# Altium schematic sheet RPL_CAN.SchDoc: CAN Bus Interface
size A; Date: Dec 27, 2017; DrawnBy: Seyed Omid Hasanli; Revision: 1.0; SheetNumber: 8
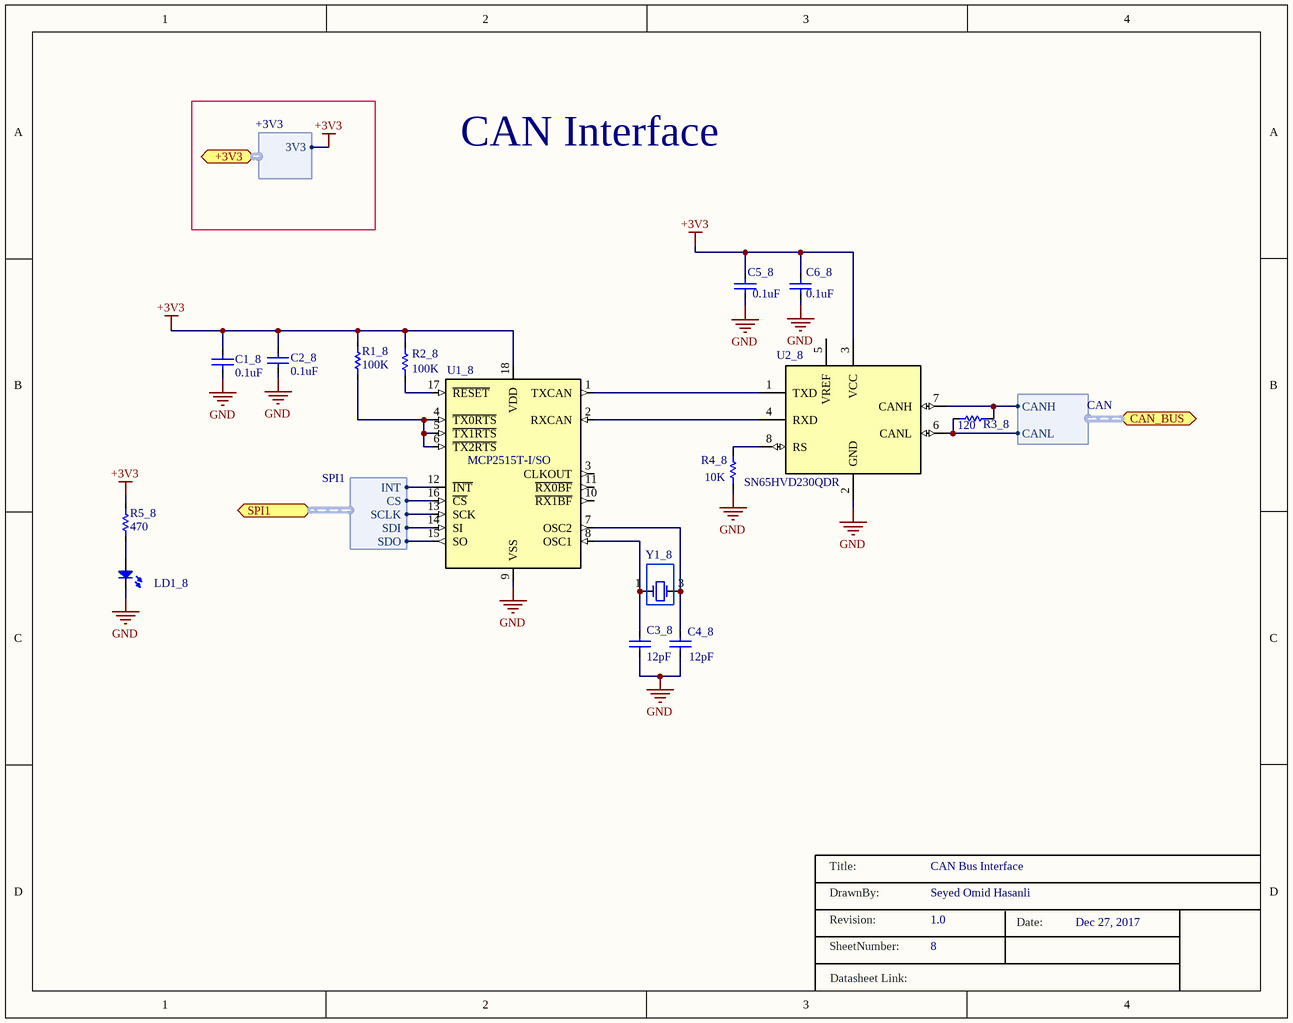
[diagram p0: RPL_CAN.SchDoc]

## Parts
C1_8  value 0.1uF  [C0805C475K9RACAUTO]  (hidden comment: Cap)
C2_8  value 0.1uF  [C0805C475K9RACAUTO]  (hidden comment: Cap)
C3_8  value 12pF  [C0805C475K9RACAUTO]  (hidden comment: Cap)
C4_8  value 12pF  [C0805C475K9RACAUTO]  (hidden comment: Cap)
C5_8  value 0.1uF  [C0805C475K9RACAUTO]  (hidden comment: Cap)
C6_8  value 0.1uF  [C0805C475K9RACAUTO]  (hidden comment: Cap)
LD1_8  LED LTST-C190GKT  [LEDM1608X80_LTST-C190GKT(Primary)]  (value not drawn)
R1_8  value 100K  [RES 0805]  (hidden comment: Res)
R2_8  value 100K  [RES 0805]  (hidden comment: Res)
R3_8  value 120  [RES 0805]  (hidden comment: Res)
R4_8  value 10K  [RES 0805]  (hidden comment: Res)
R5_8  value 470  [RES 0805]  (hidden comment: Res)
U1_8  MCP2515T-I/SO  [SOIC18-1.27-11.5X7.5MM]
U2_8  SN65HVD230QDR  [SOIC127P600X175-8N]
Y1_8  XTAL_4pin_16MHz_8pF  [OSCSC105P160X120X35-4N]  (value not drawn)

## Ports
+3V3 (harness +3V3), CAN_BUS (harness CAN), SPI1 (harness SPI1)

## Harnesses
SPI1: SCLK, SDI, SDO, INT, CS
+3V3: 3V3
CAN: CANH, CANL

## Nets
+3V3: C1_8.2 C2_8.2 C5_8.2 C6_8.2 R1_8.2 R2_8.2 R5_8.1 U1_8.18(VDD) U2_8.3(VCC) ; port +3V3.3V3
GND: C1_8.1 C2_8.1 C3_8.2 C4_8.2 C5_8.1 C6_8.1 LD1_8.C R4_8.1 U1_8.9(VSS) U2_8.2(GND)
NetC3_8_1: C3_8.1 U1_8.8(OSC1) Y1_8.1(OSC1)
NetC4_8_1: C4_8.1 U1_8.7(OSC2) Y1_8.3(OSC3)
NetLD1_8_A: LD1_8.A R5_8.2
NetR1_8_1: R1_8.1 U1_8.4(~{TX0RTS}) U1_8.5(~{TX1RTS}) U1_8.6(~{TX2RTS})
NetR2_8_1: R2_8.1 U1_8.17(~{RESET})
NetR3_8_1: R3_8.1 U2_8.7(CANH) ; port CAN_BUS.CANH
NetR3_8_2: R3_8.2 U2_8.6(CANL) ; port CAN_BUS.CANL
NetR4_8_2: R4_8.2 U2_8.8(RS)
NetU1_8_1: U1_8.1(TXCAN) U2_8.1(TXD)
NetU1_8_2: U1_8.2(RXCAN) U2_8.4(RXD)
NetU1_8_12: U1_8.12(~{INT}) ; port SPI1.INT
NetU1_8_13: U1_8.13(SCK) ; port SPI1.SCLK
NetU1_8_14: U1_8.14(SI) ; port SPI1.SDI
NetU1_8_16: U1_8.16(~{CS}) ; port SPI1.CS

Not connected (* = marked no-connect by the designer): U1_8 3(CLKOUT) 10(~{RX1BF}) 11(~{RX0BF}) 15(SO); U2_8 5(VREF); Y1_8 2(OSC2) 4(OSC4)

## Notes on the sheet
- CAN Interface
- Title:
- DrawnBy:
- Revision:
- SheetNumber:
- Date:
- Datasheet Link:

## Library data of the parts
LD1_8 = LED LTST-C190GKT: Green 1.6 x 0.8 x 0.8 mm 130Â° Water Clear 6 mcd 2.1 V SMT LED; MF: Lite-On; Price: 0.06 USD; MP: LTST-C190GKT; Availability: Good; Package: 0603 Lite-On; Value: *
U1_8 = MCP2515T-I/SO (SOIC18): MCP2515 Series 5.5 V 1 Mb/s Stand Alone SPI Interface CAN Controller- SOIC-18; MF: Microchip; Package: SOIC-18 Microchip; Availability: Good; MP: MCP2515T-I/SO; Price: 1.63 USD; Value: *
U2_8 = SN65HVD230QDR: 3.3-V CAN Transceiver with Standby Mode 8-SOIC -40 to 125; MF: Texas Instruments; Package: SOIC-8 Texas Instruments; Availability: Good; MP: SN65HVD230QDR; Price: 1.74 USD; Value: *